# Altium schematic sheet EchoSAT 2 PCB SchDoc.SchDoc
size 420 x 297 mm; SheetNumber: 1; SheetTotal: 1
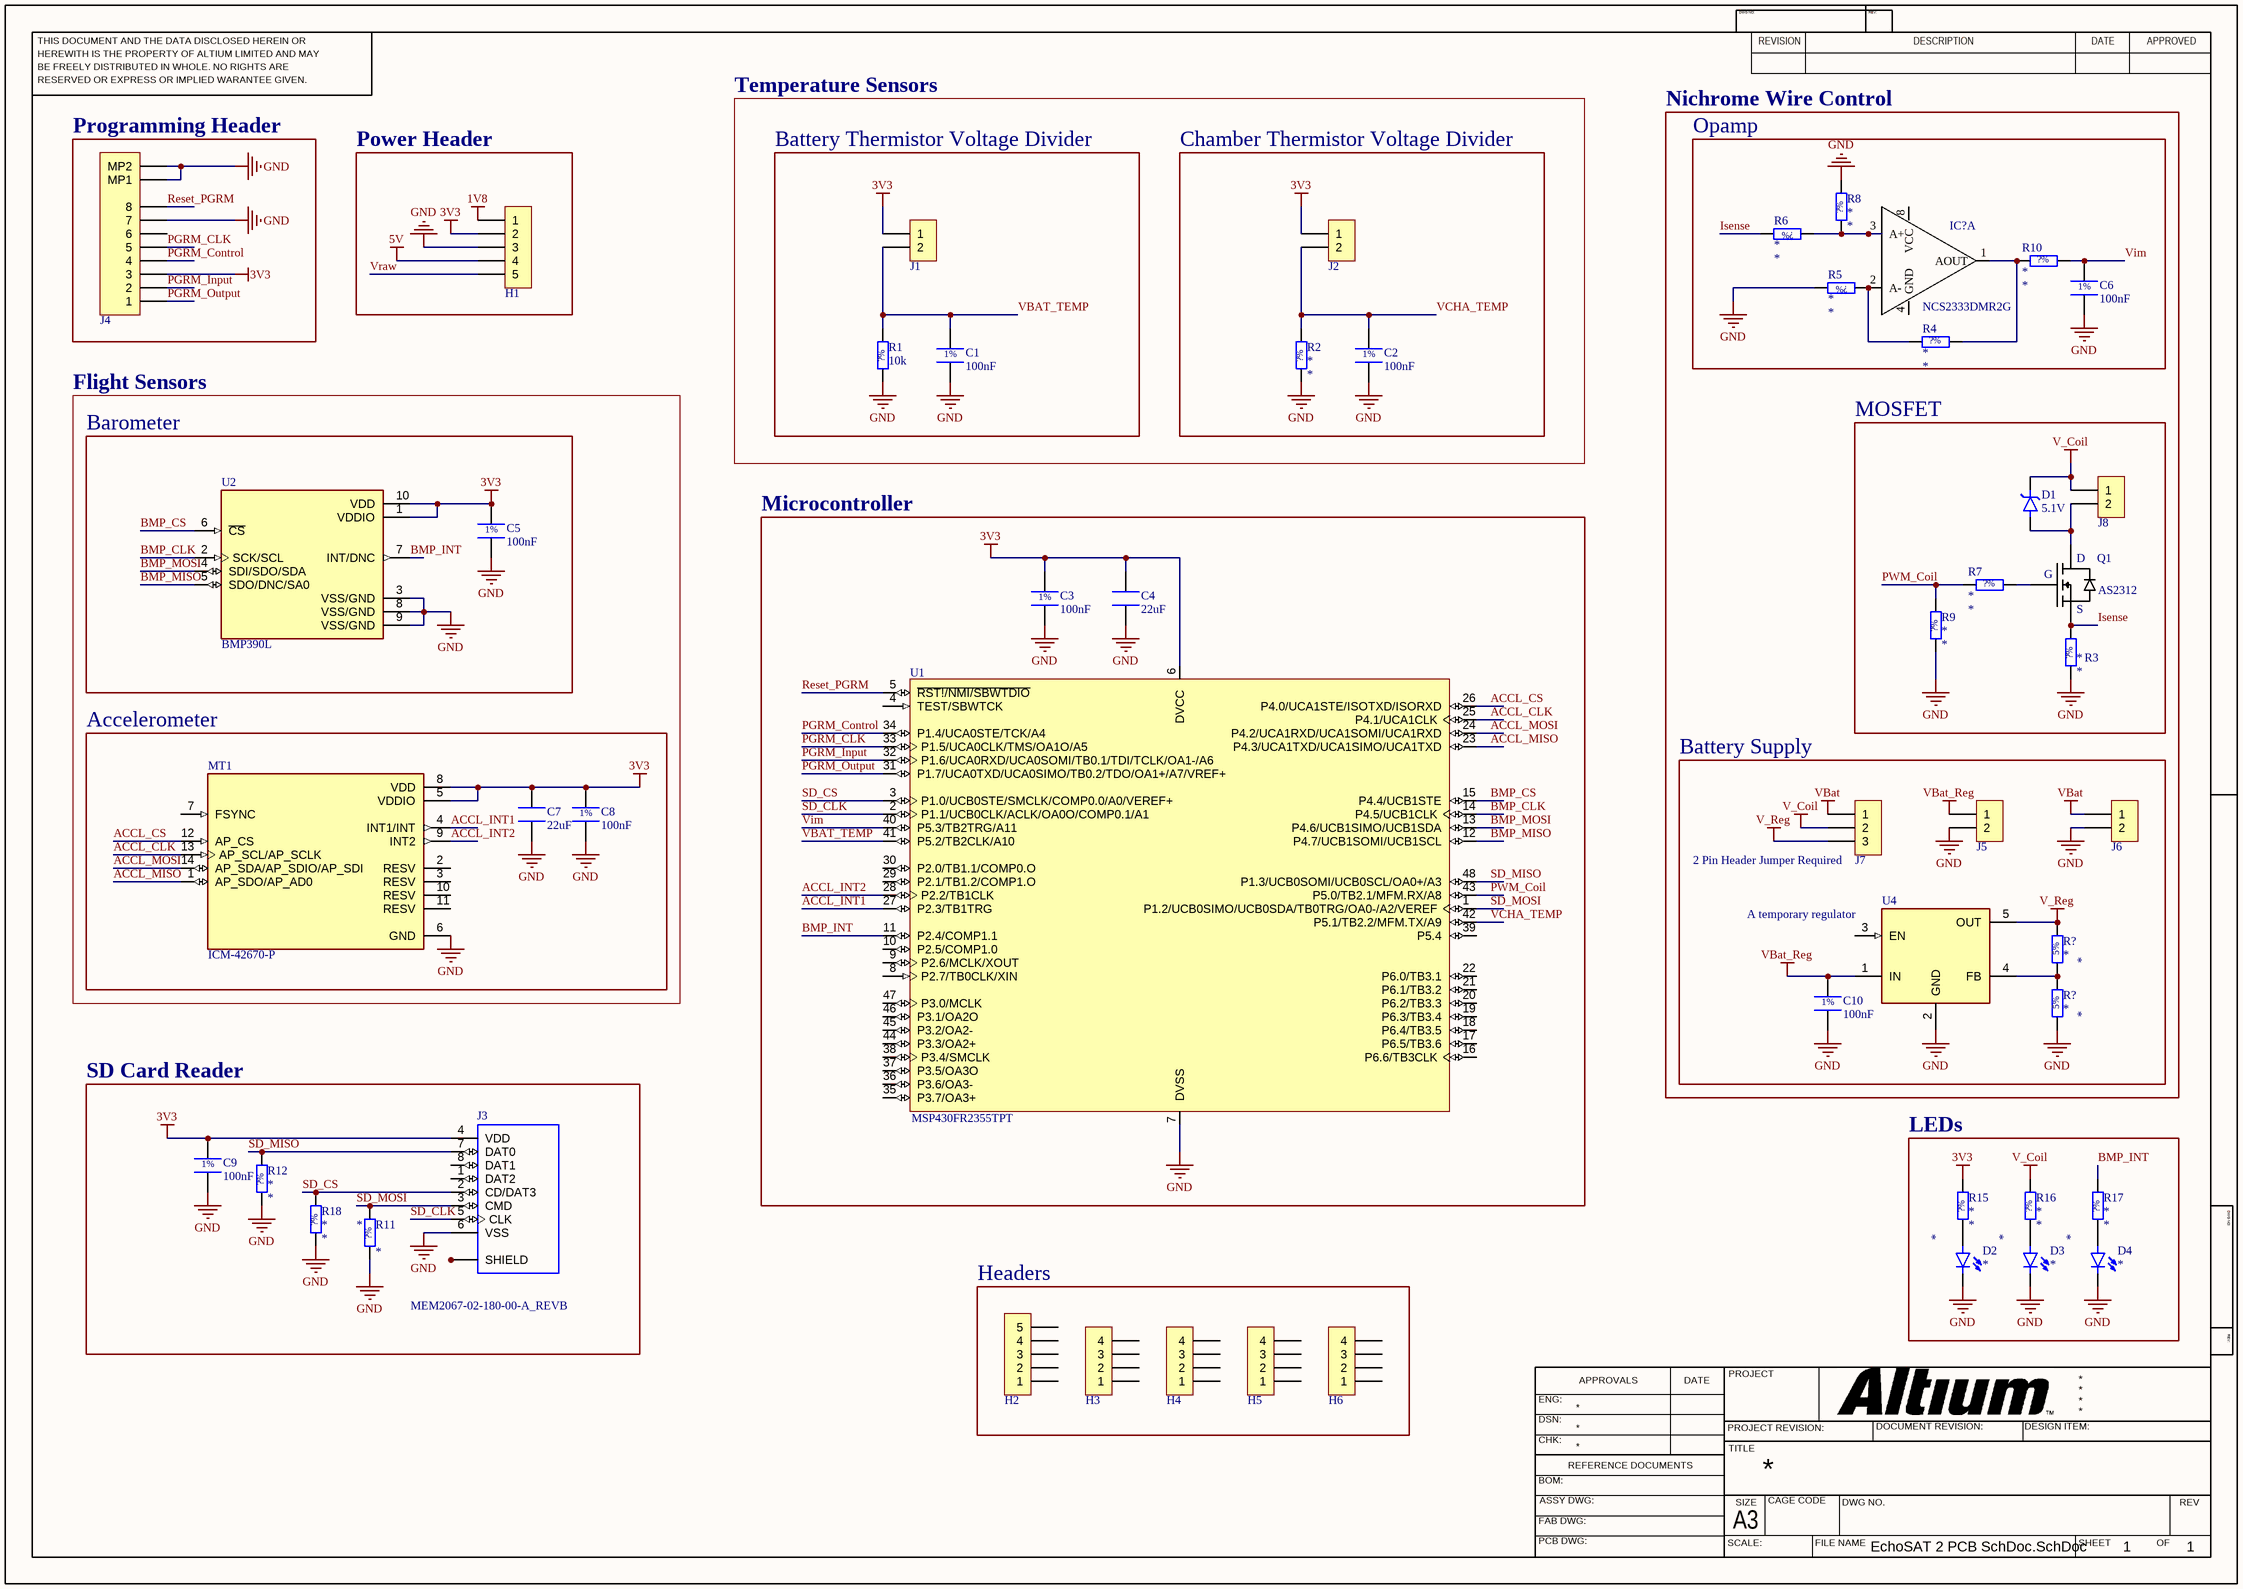
[diagram p0: EchoSAT 2 PCB SchDoc.SchDoc]

## Parts
(Parts that share a designator on the sheet are numbered #1, #2 ... from top to bottom, then left to right.)
C1  100nF  [CAPACITOR_0402_1005M_55N]
C2  100nF  [CAPACITOR_0402_1005M_55N]
C3  100nF  [CAPACITOR_0402_1005M_55N]
C4  22uF  [CAPACITOR_0805_2012M-70N]
C5  100nF  [CAPACITOR_0402_1005M_55N]
C6  100nF  [CAPACITOR_0402_1005M_55N]
C7  22uF  [CAPACITOR_0805_2012M-70N]
C8  100nF  [CAPACITOR_0402_1005M_55N]
C9  100nF  [CAPACITOR_0402_1005M_55N]
C10  100nF  [CAPACITOR_0402_1005M_55N]
D1  value 5.1V  [SOD123-1.35mm-N]  (hidden comment: BZT52C5V1-TP)
D2  LTST-C190 Series  [LED_0603_1608M_0.80mm]  (value not drawn)
D3  LTST-C190 Series  [LED_0603_1608M_0.80mm]  (value not drawn)
D4  LTST-C190 Series  [LED_0603_1608M_0.80mm]  (value not drawn)
H1  HDR,2.54mm,1x5  [HEADER_2.54MM_1x5PIN]  (value not drawn)  (no BOM)
H2  HDR,2.54mm,1x5  [HEADER_2.54MM_1x5PIN]  (value not drawn)  (no BOM)
H3  HDR,2.54mm,1x4  [HEADER_2.54MM_1x4PIN]  (value not drawn)  (no BOM)
H4  HDR,2.54mm,1x4  [HEADER_2.54MM_1x4PIN]  (value not drawn)  (no BOM)
H5  HDR,2.54mm,1x4  [HEADER_2.54MM_1x4PIN]  (value not drawn)  (no BOM)
H6  HDR,2.54mm,1x4  [HEADER_2.54MM_1x4PIN]  (value not drawn)  (no BOM)
IC?  NCS2333DMR2G  [*MSOP8]  (part A of 2)
J1  0530470210  [MOLEX_0530470210]  (value not drawn)
J2  0530470210  [MOLEX_0530470210]  (value not drawn)
J3  MEM2067-02-180-00-A_REVB  [GCT_MEM2067-02-180-00-A_REVB]
J4  0532610871  [MOLEX_0532610871]  (value not drawn)
J5  0530470210  [MOLEX_0530470210]  (value not drawn)
J6  0530470210  [MOLEX_0530470210]  (value not drawn)
J7  0530470310  [MOLEX_0530470310]  (value not drawn)
J8  0530470210  [MOLEX_0530470210]  (value not drawn)
MT1  ICM-42670-P  [XDCR_ICM-42670-P]
Q1  AS2312  [SOT23-3N-1.15mm]
R1  10k  [RESISTOR_0805_2012M-50N]
R2  *  [RESISTOR_0805_2012M-50N]
R3  *  [RESISTOR_0805_2012M-50N]
R4  *  [RESISTOR_0805_2012M-50N]
R5  *  [RESISTOR_0805_2012M-50N]
R6  *  [RESISTOR_0805_2012M-50N]
R7  *  [RESISTOR_0805_2012M-50N]
R8  *  [RESISTOR_0805_2012M-50N]
R9  *  [RESISTOR_0805_2012M-50N]
R10  *  [Resistor_0805_2012M-50N]
R11  *  [RESISTOR_0805_2012M-50N]
R12  *  [RESISTOR_0805_2012M-50N]
R15  *  [RESISTOR_0805_2012M-50N]
R16  *  [RESISTOR_0805_2012M-50N]
R17  *  [RESISTOR_0805_2012M-50N]
R18  *  [RESISTOR_0805_2012M-50N]
R?#1  *  [RESISTOR_0402_1005M_37N]
R?#2  *  [RESISTOR_0402_1005M_37N]
U1  MSP430FR2355TPT  [LQFP_PT_48_N]
U2  BMP390L  [XDCR_BMP390L]
U4  TLV75801PDBVR  [SOT23-5N-1.45mm]  (value not drawn)

## Blocks framed on the sheet
Programming Header: J4
Opamp: C6 IC? R4-R6 R8 R10
Power Header: H1
Battery Thermistor Voltage Divider: C1 J1 R1
Chamber Thermistor Voltage Divider: C2 J2 R2
MOSFET: D1 J8 Q1 R3 R7 R9
Barometer: C5 U2
Microcontroller: C3 C4 U1
Accelerometer: C7 C8 MT1
Battery Supply: C10 J5-J7 R?#1 R?#2 U4
SD Card Reader: C9 J3 R11 R12 R18
LEDs: D2-D4 R15-R17
Headers: H2-H6

## Nets
1V8: H1.1
3V3: C3.2 C4.2 C5.2 C7.2 C8.2 C9.2 H1.2 J1.1 J2.1 J3.4(VDD) J4.3 MT1.5(VDDIO) MT1.8(VDD) R15.2 U1.6(DVCC) U2.1(VDDIO) U2.10(VDD)
5V: H1.4
GND: C1.1 C2.1 C3.1 C4.1 C5.1 C6.1 C7.1 C8.1 C9.1 C10.1 D2.C D3.C D4.C H1.3 J3.6(VSS) J4.7 J4.MP1 J4.MP2 J5.2 J6.2 MT1.6(GND) R1.1 R2.1 R3.1 R5.2 R8.2 R9.1 R11.1 R12.1 R18.1 R?#2.1 U1.7(DVSS) U2.3(VSS/GND) U2.8(VSS/GND) U2.9(VSS/GND) U4.2(GND)
V_Coil: D1.C J7.2 J8.1 R16.2
V_Reg: J7.3 R?#1.2 U4.5(OUT)
VBat: J6.1 J7.1
VBat_Reg: C10.2 J5.1 U4.1(IN)
ACCL_CLK: MT1.13(AP_SCL/AP_SCLK) U1.25(P4.1/UCA1CLK)
ACCL_CS: MT1.12(AP_CS) U1.26(P4.0/UCA1STE/ISOTXD/ISORXD)
ACCL_INT1: MT1.4(INT1/INT) U1.27(P2.3/TB1TRG)
ACCL_INT2: MT1.9(INT2) U1.28(P2.2/TB1CLK)
ACCL_MISO: MT1.1(AP_SDO/AP_AD0) U1.23(P4.3/UCA1TXD/UCA1SIMO/UCA1TXD)
ACCL_MOSI: MT1.14(AP_SDA/AP_SDIO/AP_SDI) U1.24(P4.2/UCA1RXD/UCA1SOMI/UCA1RXD)
BMP_CLK: U1.14(P4.5/UCB1CLK) U2.2(SCK/SCL)
BMP_CS: U1.15(P4.4/UCB1STE) U2.6(~{CS})
BMP_INT: R17.2 U1.11(P2.4/COMP1.1) U2.7(INT/DNC)
BMP_MISO: U1.12(P4.7/UCB1SOMI/UCB1SCL) U2.5(SDO/DNC/SA0)
BMP_MOSI: U1.13(P4.6/UCB1SIMO/UCB1SDA) U2.4(SDI/SDO/SDA)
Isense: Q1.2(S) R3.2 R6.2
PGRM_CLK: J4.5 U1.33(P1.5/UCA0CLK/TMS/OA1O/A5)
PGRM_Control: J4.4 U1.34(P1.4/UCA0STE/TCK/A4)
PGRM_Input: J4.2 U1.32(P1.6/UCA0RXD/UCA0SOMI/TB0.1/TDI/TCLK/OA1-/A6)
PGRM_Output: J4.1 U1.31(P1.7/UCA0TXD/UCA0SIMO/TB0.2/TDO/OA1+/A7/VREF+)
PWM_Coil: R7.1 R9.2 U1.43(P5.0/TB2.1/MFM.RX/A8)
Reset_PGRM: J4.8 U1.5(~{RST!/NMI/SBWTDIO})
SD_CLK: J3.5(CLK) U1.2(P1.1/UCB0CLK/ACLK/OA0O/COMP0.1/A1)
SD_CS: J3.2(CD/DAT3) R18.2 U1.3(P1.0/UCB0STE/SMCLK/COMP0.0/A0/VEREF+)
SD_MISO: J3.7(DAT0) R12.2 U1.48(P1.3/UCB0SOMI/UCB0SCL/OA0+/A3)
SD_MOSI: J3.3(CMD) R11.2 U1.1(P1.2/UCB0SIMO/UCB0SDA/TB0TRG/OA0-/A2/VEREF)
VBAT_TEMP: C1.2 J1.2 R1.2 U1.41(P5.2/TB2CLK/A10)
VCHA_TEMP: C2.2 J2.2 R2.2 U1.42(P5.1/TB2.2/MFM.TX/A9)
Vim: C6.2 R10.2 U1.40(P5.3/TB2TRG/A11)
Vraw: H1.5
NetD1_A: D1.A J8.2 Q1.3(D)
NetD2_A: D2.A R15.1
NetD3_A: D3.A R16.1
NetD4_A: D4.A R17.1
NetIC?_1: IC?.1(AOUT) R4.2 R10.1
NetIC?_2: IC?.2(A-) R4.1 R5.1
NetIC?_3: IC?.3(A+) R6.1 R8.1
NetJ3_9: J3.9(SHIELD) J3.10(SHIELD) J3.11(SHIELD) J3.12(SHIELD)
NetQ1_1: Q1.1(G) R7.2
NetR?#1_1: R?#1.1 R?#2.2 U4.4(FB)

Not connected (* = marked no-connect by the designer): H2 1 2 3 4 5; H3 1 2 3 4; H4 1 2 3 4; H5 1 2 3 4; H6 1 2 3 4; IC? 4(GND) 8(VCC); J3 1(DAT2) 8(DAT1); J4 6; MT1 2(RESV) 3(RESV) 7(FSYNC) 10(RESV) 11(RESV); U1 4(TEST/SBWTCK) 8(P2.7/TB0CLK/XIN) 9(P2.6/MCLK/XOUT) 10(P2.5/COMP1.0) 16(P6.6/TB3CLK) 17(P6.5/TB3.6) 18(P6.4/TB3.5) 19(P6.3/TB3.4) 20(P6.2/TB3.3) 21(P6.1/TB3.2) 22(P6.0/TB3.1) 29(P2.1/TB1.2/COMP1.O) 30(P2.0/TB1.1/COMP0.O) 35(P3.7/OA3+) 36(P3.6/OA3-) 37(P3.5/OA3O) 38(P3.4/SMCLK) 39(P5.4) 44(P3.3/OA2+) 45(P3.2/OA2-) 46(P3.1/OA2O) 47(P3.0/MCLK); U4 3(EN)

## Notes on the sheet
- Temperature Sensors
- Nichrome Wire Control
- Flight Sensors
- (near J7) 2 Pin Header Jumper Required
- (near U4) A temporary regulator
- THIS DOCUMENT AND THE DATA DISCLOSED HEREIN OR
- HEREWITH IS THE PROPERTY OF ALTIUM LIMITED AND MAY
- DWG NO:
- REVISION
- REV:
- DESCRIPTION
- DATE
- APPROVED
- BE FREELY DISTRIBUTED IN WHOLE. NO RIGHTS ARE
- RESERVED OR EXPRESS OR IMPLIED WARANTEE GIVEN.
- ENG:
- APPROVALS
- PROJECT
- DSN:
- CHK:
- REFERENCE DOCUMENTS
- PROJECT REVISION:
- TITLE
- DOCUMENT REVISION:
- DESIGN ITEM:
- BOM:
- FAB DWG:
- PCB DWG:
- ASSY DWG:
- SCALE:
- A3
- SIZE
- CAGE CODE
- FILE NAME
- DWG NO.
- SHEET
- OF
- REV
- (in symbol GCM1555CxxxxxF Series) 1%

## Library data of the parts
C1-C3 C5 C6 C8-C10 = GCM1555CxxxxxF Series: Passive - Capacitor Series, C0G, 5pF ~ 1nF, 50V, 0402 (1005 Metric), ±1%, -55°C ~ 125°C; APSS Standard Part: APSS Standard; Capacitance at Rated Voltage: 100%; E Series: E24; Tolerance: ±1%; Temperature Coefficient: C0G; Rated Voltage: 50V; Value Range: 5pF ~ 1nF; Temp Range: -55°C ~ 125°C; Supplier 1: Digikey; Package: 0402; MF Part No.: *; Value: 100nF
C4 C7 = C0805C226M9PACTU: Passive - Capacitor, X5R, 22uF Max, 6.3V, 0805 (2012 Metric), ±20%, -55°C ~ 85°C. 8.8uF @ 5V; APSS Standard Part: APSS Standard; Capacitance at Rated Voltage: 30%; Tolerance: ±20%; Temperature Coefficient: X5R; Rated Voltage: 6.3V; Temp Range: -55°C ~ 85°C; Package: 0805; Supplier 1: Digikey; Supplier 1 Part No.: 399-C0805C226M9PAC7800CT-ND; MF Part No.: C0805C226M9PACTU; Value: 22uF
D1 = BZT52C5V1-TP: Diode - Zener, 5V1, SOD-123; APSS Standard Part: APSS Standard; Temp Range: -65°C ~ 150°C; MF Part No.: BZT52C5V1-TP; Package: SOD-123; Supplier 1: Digikey; Supplier 1 Part No.: BZT52C5V1-TPMSCT-ND
D2-D4 = LTST-C190 Series: Diode - LED, 0603; APSS Standard Part: APSS Standard; Temp Range: -30°C ~ 85°C; Rated Voltage: 5V Reverse; Package: 0603; Supplier 1: Digikey; MF Part No.: *; Colour: *
H1 H2 = HDR,2.54mm,1x5: Connector - 2.54mm, 1x5-pin
H3-H6 = HDR,2.54mm,1x4: Connector - 2.54mm, 1x4-pin
J1 J2 J5 J6 J8 = 0530470210: Connector - Picoblade 02-pin, TH, STR; APSS Standard Part: APSS Standard; Pitch: 1.25mm; Mounting Type: Through-hole; Orientation: Straight; MF Part No.: 0530470210; Pins: 2; Supplier 1: Digikey; Supplier 1 Part No.: WM1731-ND
J3 = MEM2067-02-180-00-A_REVB: Micro SD Memory Card ConnectorSMT, Hinged, 1.80mm Profile; Price: None; Value: *; MP: MEM2067-02-180-00-A_REVB; Package: None; Availability: Unavailable
J4 = 0532610871: Connector - Picoblade 08-pin, SMT, RA; APSS Standard Part: APSS Standard; Pitch: 1.25mm; Mounting Type: Surface Mount; Orientation: Right Angle; MF Part No.: 0532610871; Pins: 8; Supplier 1: Digikey; Supplier 1 Part No.: WM7626CT-ND
J7 = 0530470310: Connector - Picoblade 03-pin, TH, STR; APSS Standard Part: APSS Standard; Pitch: 1.25mm; Mounting Type: Through-hole; Orientation: Straight; MF Part No.: 0530470310; Pins: 3; Supplier 1: Digikey; Supplier 1 Part No.: WM1732-ND
Q1 = AS2312: Transistor - MOSFET, N-Channel AS2312; APSS Standard Part: APSS Standard; Temp Range: 0°C ~ 150°C (TJ); Rated Voltage: 20 Vds; Power: 1.2W; MF Part No.: AS2312; Package: SOT-23-3; Supplier 1: Digikey; Supplier 1 Part No.: 4530-AS2312CT-ND
R1-R12 R15-R18 = Generic Resistor: Passive - Resistor, Generic; Tolerance: ?%; MF Part No.: *
  R1: Value: 10k
  R2-R12 R15-R18: Value: *
R?#1 R?#2 = RMCF0402JT Series: Passive - Resistor Series, 0402, 5%, 1R - 20M, E24, 0.063W, 1/16W, ±100ppm/°C, -55°C ~ 155°C, 0402 (1005 Metric); APSS Standard Part: APSS Standard; Value Range: 1 ~ 20M; Rated Voltage: 50V; Tolerance: 5%; Power: 1/16W; E Series: E24; Temp Range: -55°C ~ 155°C; Supplier 1: Digikey; Package: 0402; Temperature Coefficient: ±100ppm/°C; MF Part No.: *; Value: *
U1 = MSP430FR2355TPT: IC - Microcontroller, LQFP-48, 24MHz, 32KB FRAM, Op-Amps/PGAs, 12-bit DACs, 12-bit ADC, -40 to 105C; APSS Standard Part: APSS Standard; Temp Range: -40°C ~ 105°C; Rated Voltage: 3.6V; MF Part No.: MSP430FR2355TPT; Package: LQFP-48; Supplier 1: Digikey; Supplier 1 Part No.: 296-50260-ND
U2 = BMP390L: Pressure Sensor 4.35PSI ~ 18.13PSI (30kPa ~ 125kPa) Absolute - - 10-WFLGA; MF: Bosch Sensortec; SnapEDA_Link: https://www.snapeda.com/parts/BMP390L/Bosch+Sensortec/view-part/?ref=snap; Package: None; Value: *; MP: BMP390L; Check_prices: https://www.snapeda.com/parts/BMP390L/Bosch+Sensortec/view-part/?ref=eda
U4 = TLV75801PDBVR: IC - Regulator, LDO, 500 mA, Low Quiescent Current, SOT23-5; APSS Standard Part: APSS Standard; Temp Range: -40°C ~ 125°C (TJ); Rated Voltage: 6V; MF Part No.: TLV75801PDBVR; Package: SOT-23-5; Supplier 1: Digikey; Supplier 1 Part No.: 296-TLV75801PDBVRCT-ND
IC? = NCS2333DMR2G: SnapEDA_Link: https://www.snapeda.com/parts/NCS2333DMR2G/Onsemi/view-part/?ref=snap; Check_prices: https://www.snapeda.com/parts/NCS2333DMR2G/Onsemi/view-part/?ref=eda; Value: *
MT1 = ICM-42670-P: Package: None; Price: None; Value: *; MP: ICM-42670-P; Availability: Unavailable